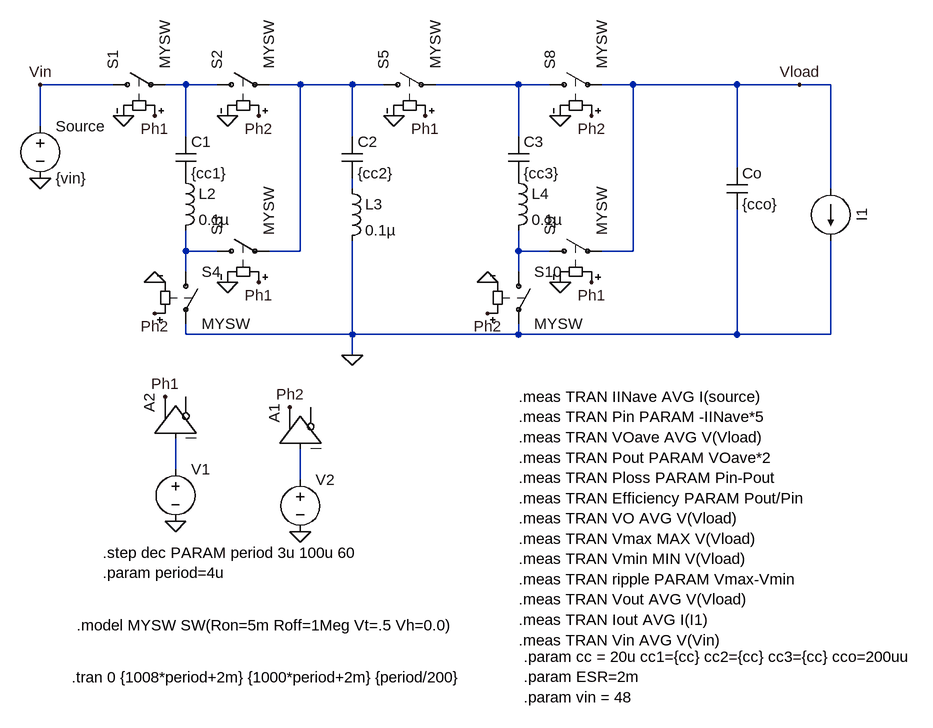
[diagram p0: schematic 4to1_doubler_distributed.asc]
4to1_doubler_distributed.asc, the LTspice schematic file:
Version 4
SHEET 1 1688 916
WIRE -592 -224 -704 -224
WIRE -480 -224 -512 -224
WIRE -432 -224 -480 -224
WIRE -304 -224 -352 -224
WIRE -224 -224 -304 -224
WIRE -176 -224 -224 -224
WIRE 32 -224 -96 -224
WIRE 80 -224 32 -224
WIRE 208 -224 160 -224
WIRE 368 -224 208 -224
WIRE 464 -224 368 -224
WIRE 512 -224 464 -224
WIRE -704 -160 -704 -224
WIRE -480 -144 -480 -224
WIRE -224 -144 -224 -224
WIRE 32 -144 32 -224
WIRE 368 -96 368 -224
WIRE -224 -64 -224 -80
WIRE 512 -64 512 -224
WIRE -480 32 -480 0
WIRE -432 32 -480 32
WIRE -304 32 -304 -224
WIRE -304 32 -352 32
WIRE 32 32 32 0
WIRE 80 32 32 32
WIRE 208 32 208 -224
WIRE 208 32 160 32
WIRE -480 64 -480 32
WIRE 32 64 32 32
WIRE -480 160 -480 144
WIRE -224 160 -224 16
WIRE -224 160 -480 160
WIRE 32 160 32 144
WIRE 32 160 -224 160
WIRE 368 160 368 -32
WIRE 368 160 32 160
WIRE 512 160 512 16
WIRE 512 160 368 160
WIRE -224 192 -224 160
WIRE -496 368 -496 320
WIRE -304 384 -304 336
FLAG -304 464 0
FLAG -704 -80 0
FLAG -528 -176 Ph1
FLAG -368 -176 Ph2
FLAG -576 -176 0
FLAG -416 -176 0
FLAG -704 -224 Vin
FLAG 464 -224 Vload
FLAG -320 272 Ph2
FLAG -112 -176 Ph1
FLAG -160 -176 0
FLAG 144 -176 Ph2
FLAG 96 -176 0
FLAG -224 192 0
FLAG -368 80 Ph1
FLAG 144 80 Ph1
FLAG -528 128 Ph2
FLAG -16 128 Ph2
FLAG -528 80 0
FLAG -416 80 0
FLAG -16 80 0
FLAG 96 80 0
FLAG -496 448 0
FLAG -512 256 Ph1
SYMBOL voltage -304 368 R0
WINDOW 123 0 0 Left 2
WINDOW 39 0 0 Left 2
WINDOW 3 24 96 Invisible 2
SYMATTR Value PULSE(0 1 {period/2} 1p 1p {period/2 - 1p} {period})
SYMATTR InstName V2
SYMBOL Digital\\buf -368 336 R270
SYMATTR InstName A1
SYMBOL voltage -704 -176 R0
WINDOW 123 0 0 Left 2
WINDOW 39 0 0 Left 2
SYMATTR InstName Source
SYMATTR Value {vin}
SYMBOL sw -608 -224 R270
SYMATTR InstName S1
SYMATTR Value MYSW
SYMBOL sw -448 -224 R270
SYMATTR InstName S2
SYMATTR Value MYSW
SYMBOL cap -496 -144 R0
SYMATTR InstName C1
SYMATTR Value {cc1}
SYMATTR SpiceLine ic = {vin/2}
SYMATTR SpiceLine2 Rser = {ESR}
SYMBOL cap 352 -96 R0
SYMATTR InstName Co
SYMATTR Value {cco}
SYMATTR SpiceLine ic = {vin/4}
SYMATTR SpiceLine2 Rser = {ESR}
SYMBOL current 512 -64 R0
WINDOW 0 32 40 VTop 2
WINDOW 3 96 52 Invisible 2
WINDOW 123 0 0 Left 2
WINDOW 39 0 0 Left 2
SYMATTR InstName I1
SYMATTR Value PULSE(0 2 0 {100*period} 0 1 2 1)
SYMBOL sw -480 48 R0
SYMATTR InstName S4
SYMATTR Value MYSW
SYMBOL sw -448 32 R270
SYMATTR InstName S3
SYMATTR Value MYSW
SYMBOL sw -192 -224 R270
SYMATTR InstName S5
SYMATTR Value MYSW
SYMBOL cap -240 -144 R0
SYMATTR InstName C2
SYMATTR Value {cc2}
SYMATTR SpiceLine ic = {vin/2}
SYMATTR SpiceLine2 Rser = {ESR}
SYMBOL sw 64 -224 R270
SYMATTR InstName S8
SYMATTR Value MYSW
SYMBOL cap 16 -144 R0
SYMATTR InstName C3
SYMATTR Value {cc3}
SYMATTR SpiceLine ic = {vin/4}
SYMATTR SpiceLine2 Rser = {ESR}
SYMBOL sw 64 32 R270
SYMATTR InstName S9
SYMATTR Value MYSW
SYMBOL sw 32 48 R0
SYMATTR InstName S10
SYMATTR Value MYSW
SYMBOL voltage -496 352 R0
WINDOW 123 0 0 Left 2
WINDOW 39 0 0 Left 2
WINDOW 3 24 96 Invisible 2
SYMATTR Value PULSE(0 1 0 1p 1p {period/2-1p} {period})
SYMATTR InstName V1
SYMBOL Digital\\buf -560 320 R270
SYMATTR InstName A2
SYMBOL ind -496 -96 R0
SYMATTR InstName L2
SYMATTR Value 0.1µ
SYMBOL ind -240 -80 R0
SYMATTR InstName L3
SYMATTR Value 0.1µ
SYMBOL ind 16 -96 R0
SYMATTR InstName L4
SYMATTR Value 0.1µ
TEXT -648 608 Left 2 !.model MYSW SW(Ron=5m Roff=1Meg Vt=.5 Vh=0.0)
TEXT 32 256 Left 2 !.meas TRAN IINave AVG I(source)\n.meas TRAN Pin PARAM -IINave*5\n.meas TRAN VOave AVG V(Vload)\n.meas TRAN Pout PARAM VOave*2\n.meas TRAN Ploss PARAM Pin-Pout\n.meas TRAN Efficiency PARAM Pout/Pin\n.meas TRAN VO AVG V(Vload)\n.meas TRAN Vmax MAX V(Vload)\n.meas TRAN Vmin MIN V(Vload)\n.meas TRAN ripple PARAM Vmax-Vmin\n.meas TRAN Vout AVG V(Vload)\n.meas TRAN Iout AVG I(I1)\n.meas TRAN Vin AVG V(Vin)
TEXT 40 656 Left 2 !.param cc = 20u cc1={cc} cc2={cc} cc3={cc} cco=200uu\n.param ESR=2m\n.param vin = 48
TEXT -656 688 Left 2 !.tran 0 {1008*period+2m} {1000*period+2m} {period/200}
TEXT -608 496 Left 2 !.step dec PARAM period 3u 100u 60\n.param period=4u

The netlist it stands for:
* 4to1_doubler_distributed.asc
V2 N008 0 PULSE(0 1 {period/2} 1p 1p {period/2 - 1p} {period})
A1 N008 0 0 0 0 0 Ph2 0 BUF
V§Source Vin 0 {vin}
S1 Vin N001 Ph1 0 MYSW
S2 N001 N002 Ph2 0 MYSW
C1 N001 P001 {cc1} ic = {vin/2} Rser = {ESR}
Co Vload 0 {cco} ic = {vin/4} Rser = {ESR}
I1 Vload 0 PULSE(0 2 0 {100*period} 0 1 2 1)
S4 N005 0 Ph2 0 MYSW
S3 N005 N002 Ph1 0 MYSW
S5 N002 N003 Ph1 0 MYSW
C2 N002 N004 {cc2} ic = {vin/2} Rser = {ESR}
S8 N003 Vload Ph2 0 MYSW
C3 N003 P002 {cc3} ic = {vin/4} Rser = {ESR}
S9 N006 Vload Ph1 0 MYSW
S10 N006 0 Ph2 0 MYSW
V1 N007 0 PULSE(0 1 0 1p 1p {period/2-1p} {period})
A2 N007 0 0 0 0 0 Ph1 0 BUF
L2 P001 N005 0.1µ
L3 N004 0 0.1µ
L4 P002 N006 0.1µ
.model MYSW SW(Ron=5m Roff=1Meg Vt=.5 Vh=0.0)
.meas TRAN IINave AVG I(source)
.meas TRAN Pin PARAM -IINave*5
.meas TRAN VOave AVG V(Vload)
.meas TRAN Pout PARAM VOave*2
.meas TRAN Ploss PARAM Pin-Pout
.meas TRAN Efficiency PARAM Pout/Pin
.meas TRAN VO AVG V(Vload)
.meas TRAN Vmax MAX V(Vload)
.meas TRAN Vmin MIN V(Vload)
.meas TRAN ripple PARAM Vmax-Vmin
.meas TRAN Vout AVG V(Vload)
.meas TRAN Iout AVG I(I1)
.meas TRAN Vin AVG V(Vin)
.param cc = 20u cc1={cc} cc2={cc} cc3={cc} cco=200uu
.param ESR=2m
.param vin = 48
.tran 0 {1008*period+2m} {1000*period+2m} {period/200}
.step dec PARAM period 3u 100u 60
.param period=4u
.backanno
.end